# EAGLE design bridgestuff (EAGLE 7.5.0)
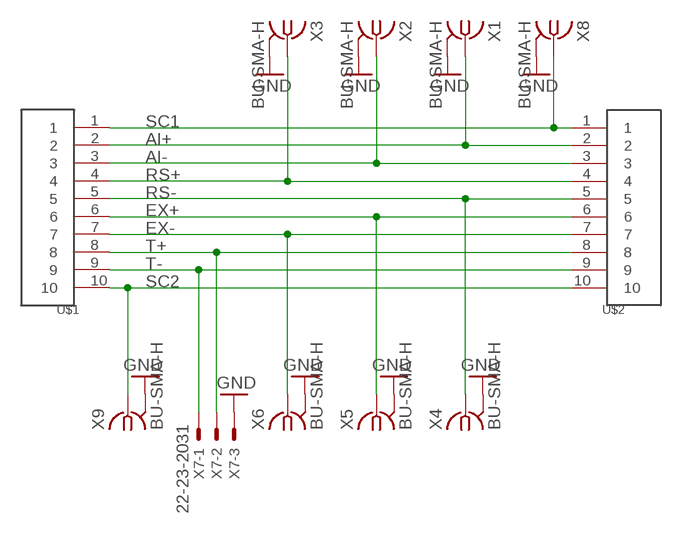
[diagram p0: schematic, sheet 1]

## Parts
U$1  RJ50-STEWARD  [RJ50]
U$2  RJ50-STEWARD  [RJ50]
X1  BU-SMA-H  [BU-SMA-H]
X2  BU-SMA-H  [BU-SMA-H]
X3  BU-SMA-H  [BU-SMA-H]
X4  BU-SMA-H  [BU-SMA-H]
X5  BU-SMA-H  [BU-SMA-H]
X6  BU-SMA-H  [BU-SMA-H]
X7  22-23-2031  [22-23-2031]
X8  BU-SMA-H  [BU-SMA-H]
X9  BU-SMA-H  [BU-SMA-H]

## Nets
AI+: U$1.2 U$2.2 X1.1
AI-: U$1.3 U$2.3 X2.1
EX+: U$1.6 U$2.6 X5.1
EX-: U$1.7 U$2.7 X6.1
GND: X1.2 X1.3 X1.4 X1.5 X2.2 X2.3 X2.4 X2.5 X3.2 X3.3 X3.4 X3.5 X4.2 X4.3 X4.4 X4.5 X5.2 X5.3 X5.4 X5.5 X6.2 X6.3 X6.4 X6.5 X7.3 X8.2 X8.3 X8.4 X8.5 X9.2 X9.3 X9.4 X9.5
RS+: U$1.4 U$2.4 X3.1
RS-: U$1.5 U$2.5 X4.1
SC1: U$1.1 U$2.1 X8.1
SC2: U$1.10 U$2.10 X9.1
T+: U$1.8 U$2.8 X7.2
T-: U$1.9 U$2.9 X7.1

## Library data of the parts
U$1 U$2 = stuff:RJ50-STEWARD
X1-X6 X8 X9 = con-coax:BU-SMA-H: FEMALE SMA CONNECTOR Radiall; OC_FARNELL: unknown; OC_NEWARK: unknown
X7 = con-molex:22-23-2031: .100" (2.54mm) Center Header - 3 Pin; MF: MOLEX; MPN: 22-23-2031; OC_FARNELL: 1462950; OC_NEWARK: 30C0862

## Board
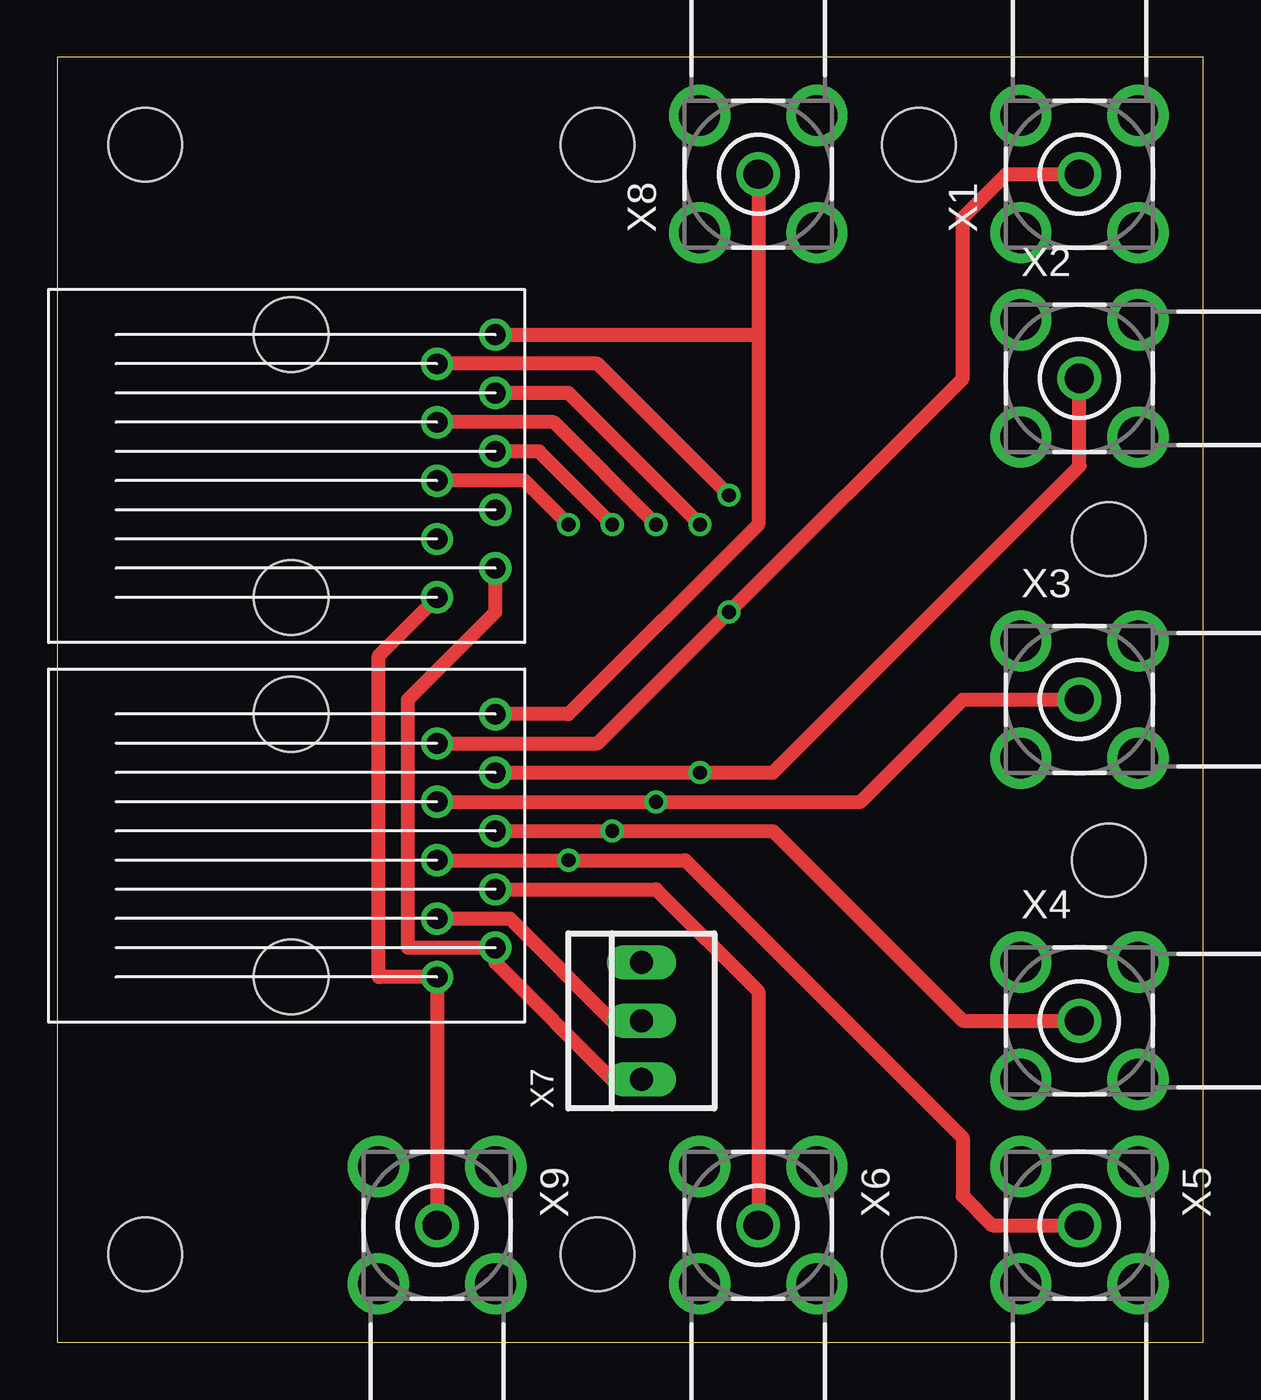
[diagram p1: board, top side]
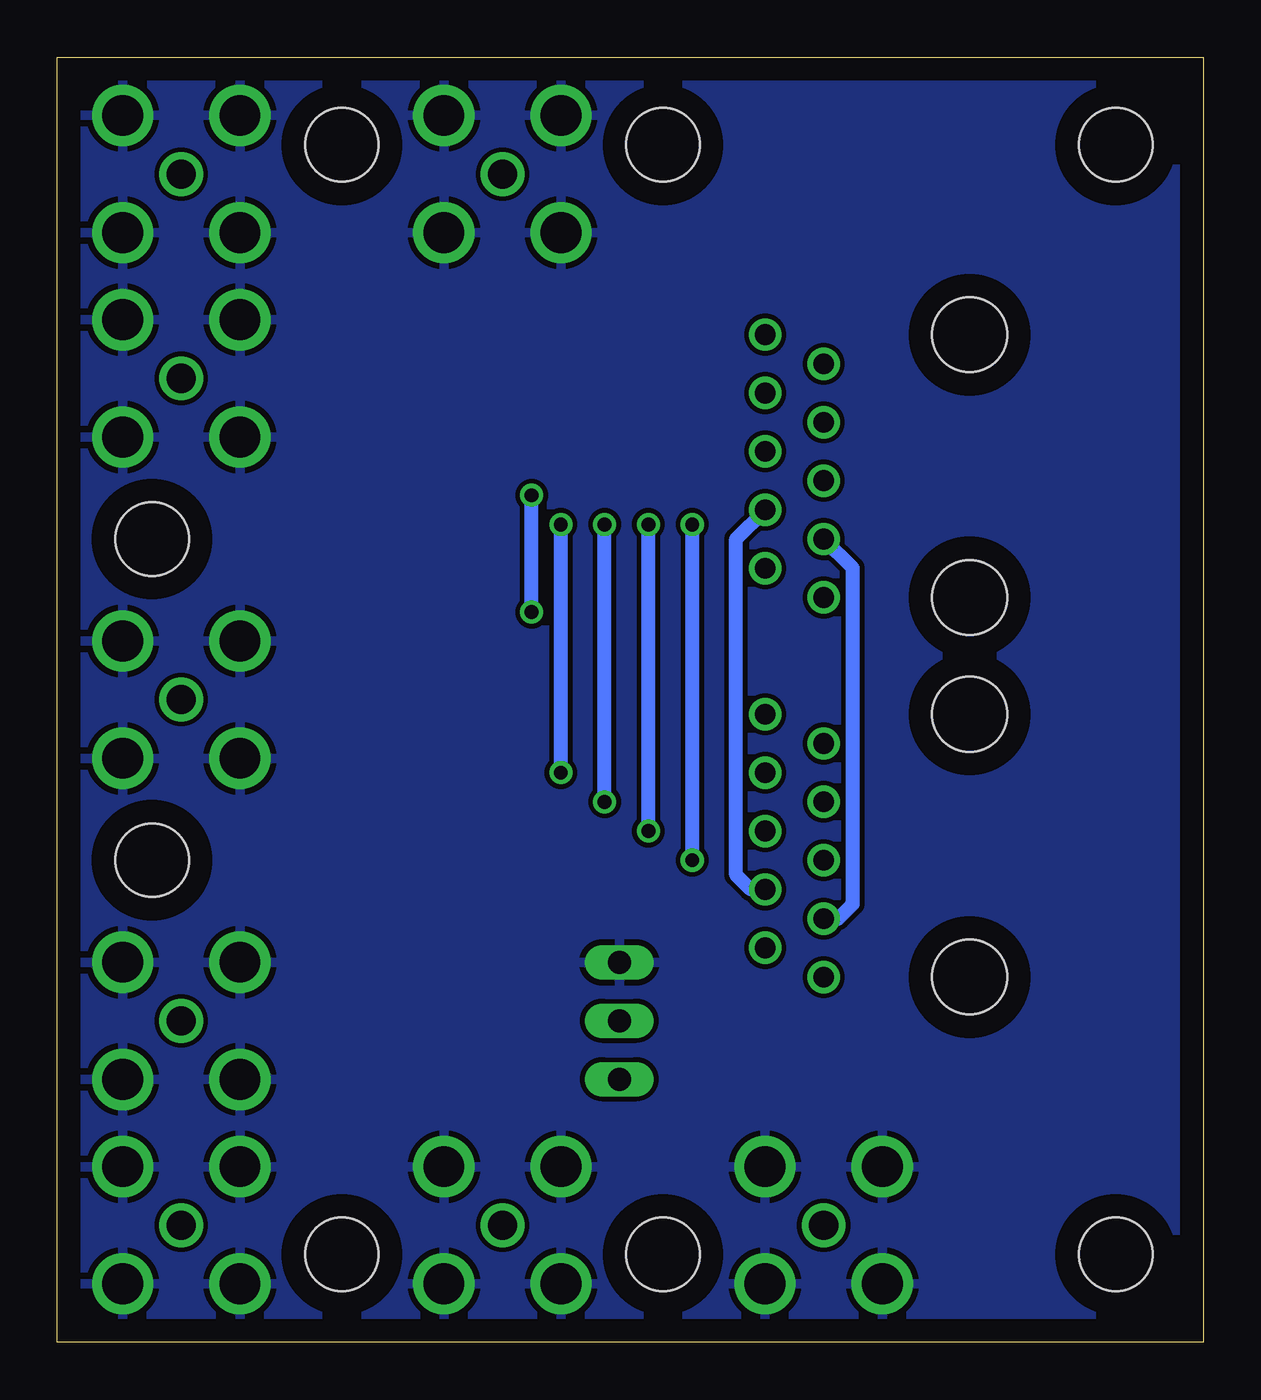
[diagram p2: board, bottom side, seen from below]

Size 49.84 x 55.87 mm. Coordinates in mm from the lower left corner, seen from the top.
Outline: 0,0 49.84,0 49.84,55.87 0,55.87 0,0
Copper layers (1*16): Top 0.035mm / dielectric 1.5mm / Bottom 0.035mm
Design rules "default": minimum track width 10mil, minimum drill 24mil, track to track 8mil, track to pad 8mil, pad to pad 8mil, via to via 8mil, smd to smd 8mil, copper to edge 40mil, drill to drill 8mil, minimum pad ring 10mil, minimum via ring 8mil, stop-mask expansion 4mil, vias tented up to drill 0mil, thermal gap 10mil
Holes 3.2 mm at 3.81,3.81 3.81,52.07 23.5,3.81 37.47,3.81 23.5,52.07 45.72,20.95 37.47,52.07 45.72,34.92

### Footprints (pad centres in the part's own frame; a part is rotated, then mirrored left to right if it is on the bottom)
RJ50 = drill 0.9: 1 -5.715,8.89; 2 -4.445,6.35; 3 -3.175,8.89; 4 -1.905,6.35; 5 -0.635,8.89; 6 0.635,6.35; 7 1.905,8.89; 8 3.175,6.35; 9 4.445,8.89; 10 5.715,6.35 | hole 3.251: -5.715,0; 5.715,0
BU-SMA-H = drill 1.27: 1 0,0 | drill 1.778: 2 -2.55,2.55; 3 2.55,2.55; 4 2.55,-2.55; 5 -2.55,-2.55
22-23-2031 = drill 1 long: 1 -2.54,0; 2 0,0; 3 2.54,0

### Placement (x,y rotation side)
U$1  10.16,21.59 270 top
U$2  10.16,38.1 270 top
X1  44.45,50.8 90 top
X2  44.45,41.91 0 top
X3  44.45,27.94 0 top
X4  44.45,13.97 0 top
X5  44.45,5.08 270 top
X6  30.48,5.08 270 top
X7  25.4,13.97 90 top
X8  30.48,50.8 90 top
X9  16.51,5.08 270 top

### Tracks (layer width: path | path; a pad name or v marks a point on that pad's centre or on a via)
AI+  (via drill 0.6)
  Top 0.61: X1.1 41.27,50.8 39.37,48.9 39.37,41.91 v29.21,31.75 23.5,26.04 U$1.2 | v29.21,36.83 23.5,42.55 U$2.2
  Bottom 0.61: v29.21,31.75 v29.21,36.83
AI-  (via drill 0.6)
  Top 0.61: X2.1 44.45,38.1 31.11,24.77 v27.94,24.77 U$1.3 | v27.94,35.56 22.23,41.27 U$2.3
  Bottom 0.61: v27.94,24.77 v27.94,35.56
EX+  (via drill 0.6)
  Top 0.61: X5.1 40.64,5.08 39.37,6.35 39.37,8.89 27.3,20.95 v22.23,20.95 U$1.6 | v22.23,35.56 20.32,37.47 U$2.6
  Bottom 0.61: v22.23,20.95 v22.23,35.56
EX-
  Top 0.61: U$1.7 26.04,19.68 30.48,15.24 X6.1
  Bottom 0.61: U$1.7 19.68,19.68 20.32,20.32 20.32,34.92 U$2.7
GND
  pour Bottom: 0,55.88 49.53,55.88 49.53,0 0,0
RS+  (via drill 0.6)
  Top 0.61: X3.1 39.37,27.94 34.92,23.5 v26.04,23.5 U$1.4 | v26.04,35.56 21.59,40.01 U$2.4
  Bottom 0.61: v26.04,23.5 v26.04,35.56
RS-  (via drill 0.6)
  Top 0.61: X4.1 39.37,13.97 31.11,22.23 v24.13,22.23 U$1.5 | v24.13,35.56 20.95,38.73 U$2.5
  Bottom 0.61: v24.13,22.23 v24.13,35.56
SC1
  Top 0.61: X8.1 30.48,43.81 | 30.48,43.81 30.48,35.56 22.23,27.3 U$1.1 | U$2.1 30.48,43.81
SC2
  Top 0.61: X9.1 U$1.10 13.97,15.88 13.97,29.84 U$2.10
T+
  Top 0.406: 24.13,13.97 X7.2
  Top 0.61: U$1.8 19.68,18.41 24.13,13.97
  Bottom 0.61: U$1.8 15.88,18.41 15.24,19.05 15.24,33.66 U$2.8
T-
  Top 0.406: 24.13,11.43 X7.1
  Top 0.61: 24.13,11.43 19.05,16.51 U$1.9 15.24,17.14 15.24,27.94 19.05,31.75 U$2.9

### Text on the board
tDocu: SC | AI+ | AI- | RS+ | T+ | RS- | T- | SC | EX- | EX+